# Altium schematic sheet ConverterSch.SchDoc: Steering Controller
size A3; Author: Harris Tomy & Neil Patil; Organization: The University of Auckland; Address1: Room XXX, Building 405; Address2: 20 Symonds Street; Address3: Auckland; Address4: New Zealand; Revision: 1R0; SheetNumber: 1; SheetTotal: 1
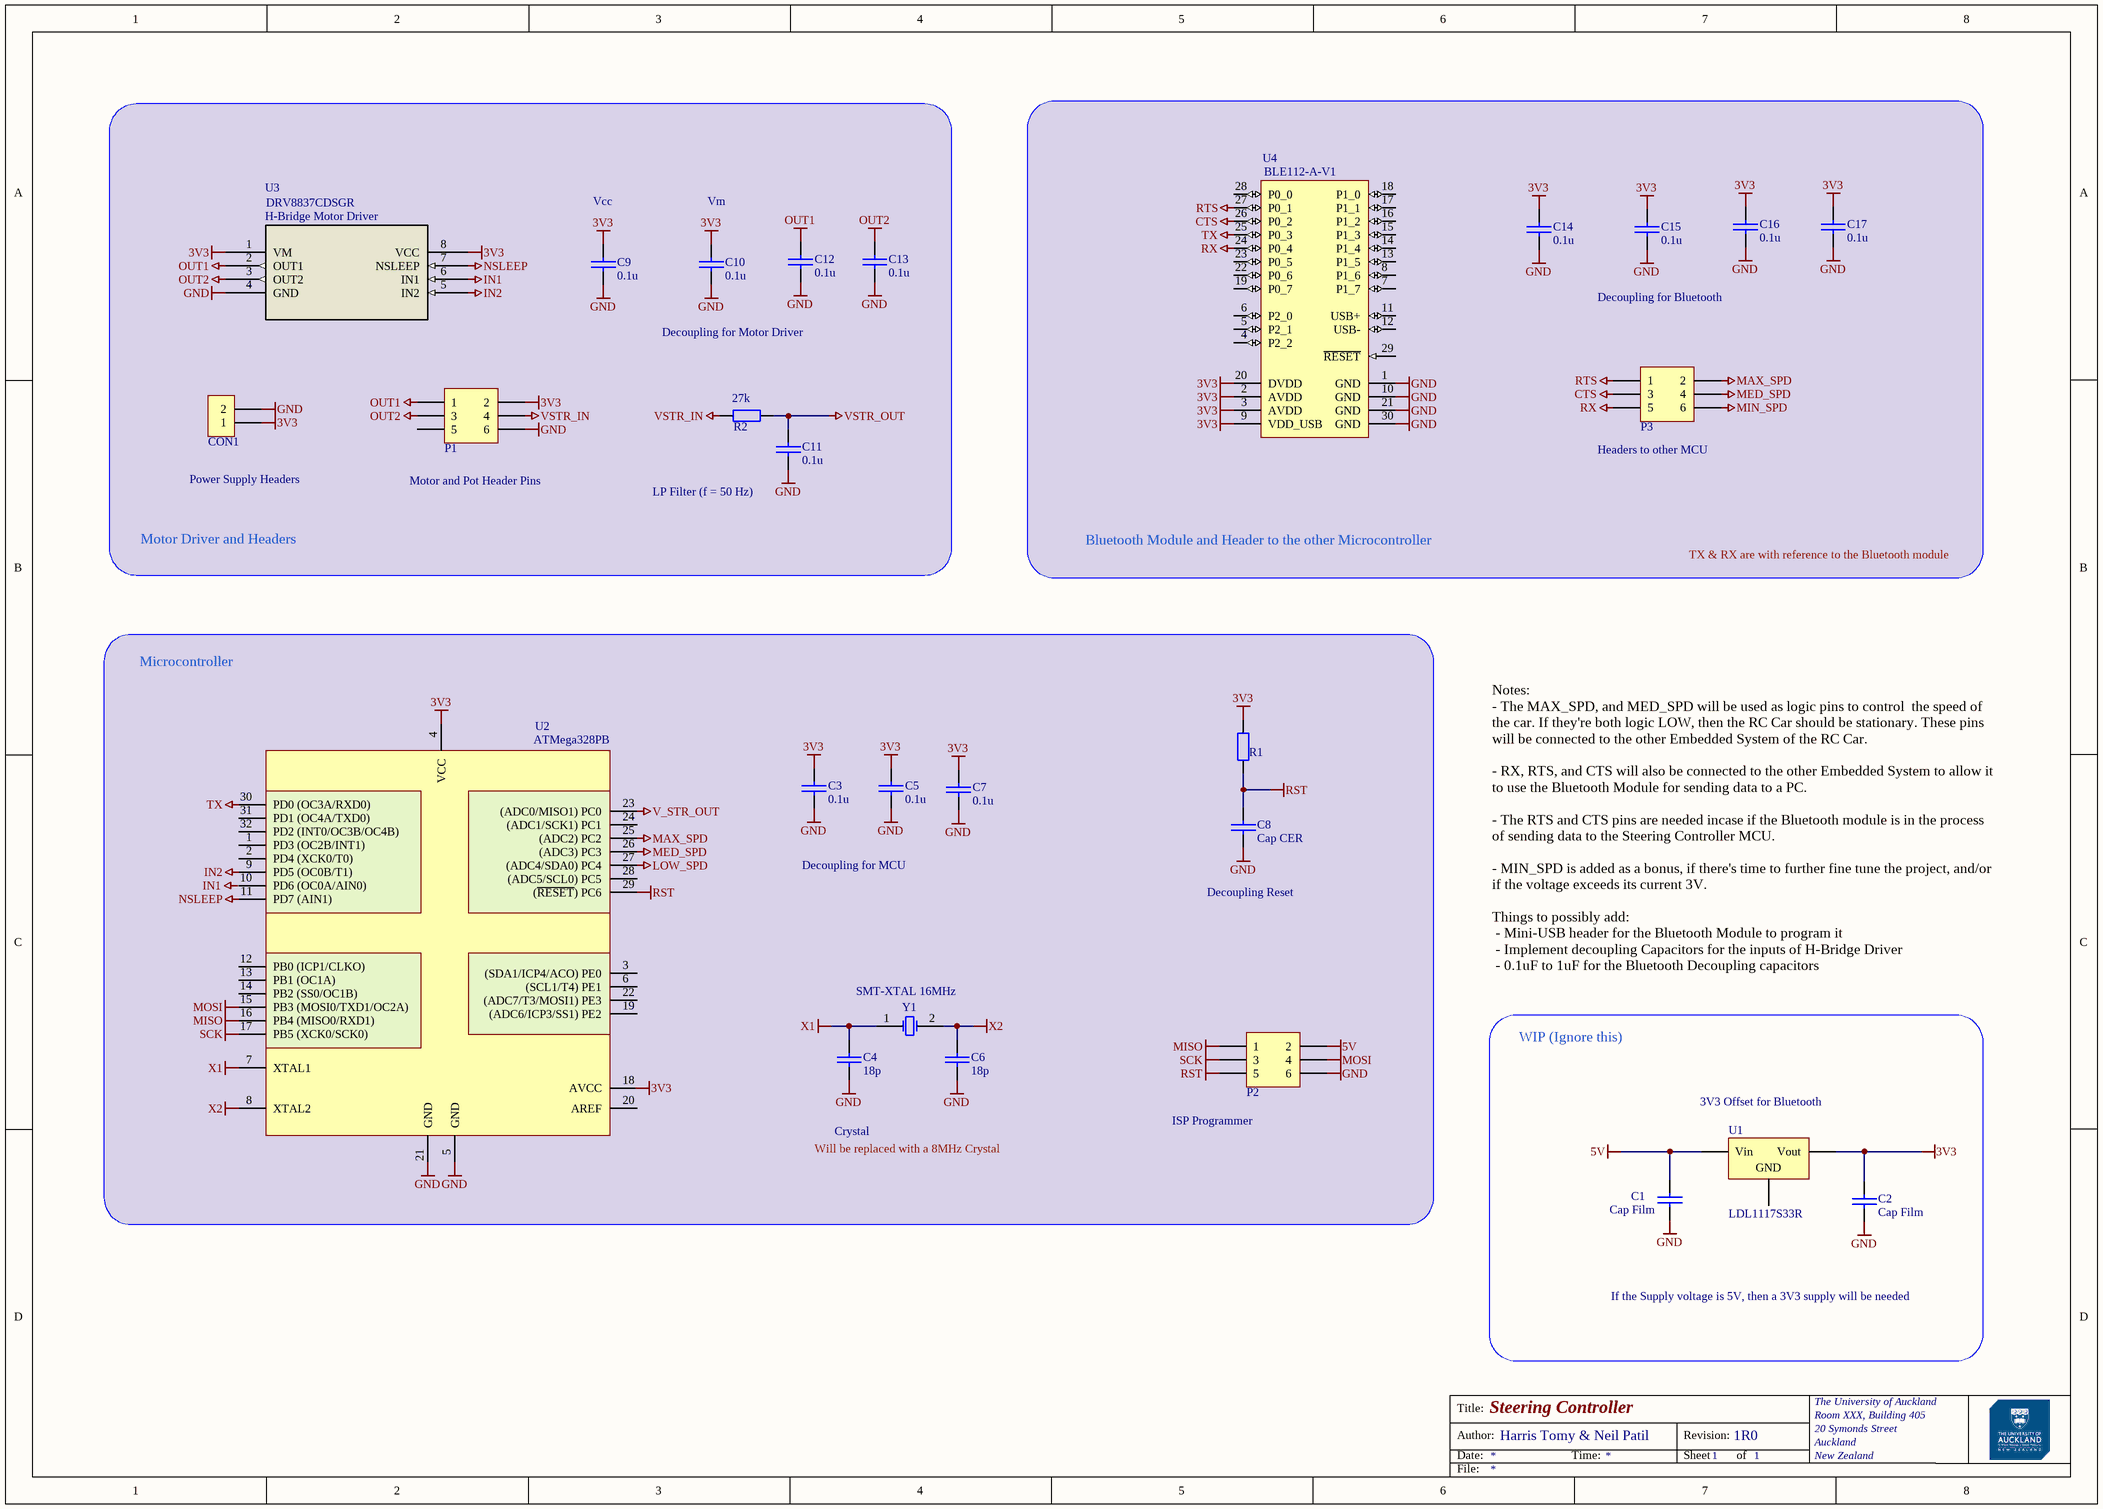
[diagram p0: ConverterSch.SchDoc]

## Parts
C1  Cap Film  [LDECE4150KA0N00]
C2  Cap Film  [LDECE4150KA0N00]
C3  0.1u  [C1206]
C4  18p  [C1206]
C5  0.1u  [C1206]
C6  18p  [C1206]
C7  0.1u  [C1206]
C8  Cap CER  [C1206]
C9  0.1u  [C1206]
C10  0.1u  [C1206]
C11  0.1u  [C1206]
C12  0.1u  [C1206]
C13  0.1u  [C1206]
C14  0.1u  [C1206]
C15  0.1u  [C1206]
C16  0.1u  [C1206]
C17  0.1u  [C1206]
CON1  Header 2X1  [HDR2X1_2P54]  (value not drawn)
P1  HDR3X2  [HDR2X3_2P54]  (value not drawn)
P2  HDR3X2  [HDR2X3_2P54]  (value not drawn)
P3  HDR3X2  [HDR2X3_2P54]  (value not drawn)
R1  Resistor 1206  [R1206]  (value not drawn)
R2  Resistor 0805  [R0805]  (value not drawn)
U1  LDL1117S33R  [SOT223L]
U2  ATMega328PB  [TQFP32]
U3  DRV8837CDSGR  [DSG8_P9X1P6_TEX]
U4  BLE112-A-V1  [BLUE-BLE112-A-V1_V]
Y1  SMT-XTAL 16MHz  [HC49-US]

## Blocks framed on the sheet
Motor Driver and Headers: C9-C13 CON1 P1 R2 U3
Bluetooth Module and Header to the other Microcontroller: C14-C17 P3 U4
Microcontroller: C3-C8 P2 R1 U2 Y1
WIP (Ignore this): C1 C2 U1

## Nets
3V3: C2.2 C3.2 C5.2 C7.2 C9.2 C10.2 C14.2 C15.2 C16.2 C17.2 CON1.1 P1.2 R1.1 U1.2(Vout) U2.4(VCC) U3.1(VM) U3.8(VCC) U4.2(AVDD) U4.3(AVDD) U4.9(VDD_USB) U4.20(DVDD)
5V: C1.2 P2.2 U1.3(Vin)
CTS: P3.3 U4.26(P0_2)
GND: C1.1 C2.1 C3.1 C4.1 C5.1 C6.1 C7.1 C8.1 C9.1 C10.1 C11.1 C12.1 C13.1 C14.1 C15.1 C16.1 C17.1 CON1.2 P1.6 P2.6 U2.5(GND) U2.21(GND) U3.4(GND) U4.1(GND) U4.10(GND) U4.21(GND) U4.30(GND)
IN1: U3.6(IN1)
IN2: U2.9(PD5_(OC0B/T1)) U3.5(IN2)
LOW_SPD: U2.27((ADC4/SDA0)_PC4)
MAX_SPD: P3.2 U2.25((ADC2)_PC2)
MED_SPD: P3.4 U2.26((ADC3)_PC3)
MIN_SPD: P3.6
MISO: P2.1 U2.16(PB4_(MISO0/RXD1))
MOSI: P2.4 U2.15(PB3_(MOSI0/TXD1/OC2A))
NSLEEP: U2.11(PD7_(AIN1)) U3.7(NSLEEP)
OUT1: C12.2 P1.1 U3.2(OUT1)
OUT2: C13.2 P1.3 U3.3(OUT2)
RST: C8.2 P2.5 R1.2 U2.29((~{RESET})_PC6)
RTS: P3.1 U4.27(P0_1)
RX: P3.5 U4.24(P0_4)
SCK: P2.3 U2.17(PB5_(XCK0/SCK0))
TX: U2.30(PD0_(OC3A/RXD0)) U4.25(P0_3)
V_STR_OUT: U2.23((ADC0/MISO1)_PC0)
VSTR_IN: P1.4 R2.1
VSTR_OUT: C11.2 R2.2
X1: C4.2 U2.7(XTAL1) Y1.1(OSC1)
X2: C6.2 U2.8(XTAL2) Y1.2(OSC2)

Not connected (* = marked no-connect by the designer): P1 5; U1 1(GND); U2 1(PD3_(OC2B/INT1)) 2(PD4_(XCK0/T0)) 3((SDA1/ICP4/ACO)_PE0) 6((SCL1/T4)_PE1) 10(PD6_(OC0A/AIN0)) 12(PB0_(ICP1/CLKO)) 13(PB1_(OC1A)) 14(PB2_(SS0/OC1B)) 18(AVCC) 19((ADC6/ICP3/SS1)_PE2) 20(AREF) 22((ADC7/T3/MOSI1)_PE3) 24((ADC1/SCK1)_PC1) 28((ADC5/SCL0)_PC5) 31(PD1_(OC4A/TXD0)) 32(PD2_(INT0/OC3B/OC4B)); U4 4(P2_2) 5(P2_1) 6(P2_0) 7(P1_7) 8(P1_6) 11(USB+) 12(USB-) 13(P1_5) 14(P1_4) 15(P1_3) 16(P1_2) 17(P1_1) 18(P1_0) 19(P0_7) 22(P0_6) 23(P0_5) 28(P0_0) 29(~{RESET})

## Notes on the sheet
- (near U3) H-Bridge Motor Driver
- (near C9) Vcc
- (near C10) Vm
- Decoupling for Bluetooth
- Decoupling for Motor Driver
- (near R2) 27k
- (near P3) Headers to other MCU
- (near CON1) Power Supply Headers
- (near P1) Motor and Pot Header Pins
- (near C11) LP Filter (f = 50 Hz)
- TX & RX are with reference to the Bluetooth module
- Decoupling for MCU
- (near C8) Decoupling Reset
- Notes:
  - The MAX_SPD, and MED_SPD will be used as logic pins to control  the speed of the car. If they're both logic LOW, then the RC Car should be stationary. These pins will be connected to the other Embedded System of the RC Car.
  - RX, RTS, and CTS will also be connected to the other Embedded System to allow it to use the Bluetooth Module for sending data to a PC.
  - The RTS and CTS pins are needed incase if the Bluetooth module is in the process of sending data to the Steering Controller MCU.
  - MIN_SPD is added as a bonus, if there's time to further fine tune the project, and/or if the voltage exceeds its current 3V.
  Things to possibly add:
  - Mini-USB header for the Bluetooth Module to program it
  - Implement decoupling Capacitors for the inputs of H-Bridge Driver
  - 0.1uF to 1uF for the Bluetooth Decoupling capacitors
- (near P2) ISP Programmer
- (near U1) 3V3 Offset for Bluetooth
- Will be replaced with a 8MHz Crystal
- Crystal
- If the Supply voltage is 5V, then a 3V3 supply will be needed
- Labels drawn without touching a wire or pin: 3V3, IN1
- Title:
- Author:
- Date:
- Time:
- Revision:
- Sheet
- of
- File:

## Library data of the parts
C1 C2 = Cap Film SMD LDECE4150KA0N00: CAP FILM 1.5UF 10% 50VDC 2824; Manufacturer: KEMET; Type: Surface mount; Value: 1.5uF/50V; MPN: LDECE4150KA0N00; Supplier 1: Element14; Supplier 2: RSComponents; Part Description: CAP FILM 1.5UF 10% 50VDC 2824; Supplier Part Number 4: 80-LDECE4150KA0N00; Supplier Part Number 3: 399-12858-1-ND; Supplier Part Number 2: 1650342; Supplier Part Number 1: 2495712; Supplier 4: Mouser; Supplier 3: Digi-Key
C3-C17 = Cap CER Decoup C3216C0G2A104J160AC: CAP CER 0.1UF 100V C0G 1206; Manufacturer: TDK Corporation; Type: Surface mount; Value: 100nF/100V; Supplier 1: RSComponents; Supplier Part Number 1: 1795799; MPN: C3216C0G2A104J160AC; Supplier 2: Element14; Part Description: CAP CER 0.1UF 100V C0G 1206; Supplier Part Number 4: 810-C3216C0G2A104J6C; Supplier Part Number 3: 445-172677-1-ND; Supplier Part Number 2: 2906828; Supplier 4: Mouser; Supplier 3: Digi-Key
CON1 = HDR2X1
P1-P3 = HDR3X2: Header, 3-Pin, Dual row
R1 = RES1206: MPN: ?; Type: Surface Mount; Value: ?; Part Description: ?
R2 = RES0805: MPN: ?; Value: ?; Part Description: ?; Type: Surface Mount
U1 = LDO LDL1117S33R: IC REG LINEAR 3.3V 1.2A SOT223; Manufacturer: STMicroelectronics; Value: 3.3V/1.2A; MPN: LDL1117S33R; Supplier 1: Element14; Type: Surface mount; Part Description: IC REG LINEAR 3.3V 1.2A SOT223; Supplier Part Number 3: 511-LDL1117S33R; Supplier Part Number 2: 497-17239-1-ND; Supplier Part Number 1: 2729708; Supplier 3: Mouser; Supplier 2: Digi-Key
U2 = ATMega328PB: IC MCU 8BIT 32KB FLASH 32TQFP; Supplier 1: Digi-Key; Supplier Part Number 1: ATMEGA328PB-AU-ND; Supplier 2: Digikey; Supplier Part Number 2: ATMEGA328PB-AU-ND
U3 = DRV8837CDSGR: No Description Available; Vendor: Texas Instruments; Built_By: EMA_Jessica; SourceLibrary: TI_2019-03-25_3; Manufacturer_Part_Number: DRV8837CDSGR; Copyright: Copyright (C) 2018 Accelerated Designs. All rights reserved; RefDes: RefDes; Type: DEV
U4 = BLE112-A-V1: Bluetooth(R) Low Energy Single Mode Module / , 2 to 3.6 V, -40 to 85 degC, 30-Pin SMD, RoHS, Tape and Reel; Min Supply Voltage: 2.1 V; Max Supply Voltage: 3.6 V; RoHSCompliant: true; ComponentLink1Description: Manufacturer URL; Min Operating Temperature: -40 degC; ComponentLink2Description: Datasheet; DatasheetVersion: Rev. 1.4, 05/2013; ComponentLink1URL: www.bluegiga.com; Packaging: Cut Tape; Pins: 64; REACH SVHC: No SVHC; Max Operating Temperature: 85 degC; PackageDescription: 30-Pin Surface Mount Device, Body 12.05 x 18.1 mm, Pitch 1.25 mm; ComponentLink2URL: http://www.mouser.com/ds/2/368/Bluegiga_Technologies_BLE112_Datasheet-558666.pdf; PackageReference: BLE112-A-V1; PartNumber: BLE112-A-V1
Y1 = TXC9C-16_XTAL_SMT: 9C-16.000MAAJ-T crystal 16.0000MHZ 18PF SMD; Manufacturer: TXC CORPORATION; Frequency Stability: ±30ppm; Operating Mode: Fundamental; Supplier 1: Digi-Key; Manufacturer Part Number: 9C-16.000MAAJ-T; RoHS: RoHS Compliant; Category: Crystals, Oscillators, Resonators; Stock 1: 11514; Pricing 1: 1=0.75, 10=0.628, 50=0.5656, 100=0.5026, 500=0.47744 (NZD); Packaging: Cut Tape (CT); Part Status: Active; Type: MHz Crystal; Frequency Tolerance: ±30ppm; Load Capacitance: 18pF; Operating Temperature: -20°C ~ 70°C; Ratings: -; Mounting Type: Surface Mount; Package / Case: HC-49/US; Size / Dimension: 0.449" L x 0.189" W (11.40mm x 4.80mm); Height - Seated (Max): 0.161" (4.10mm); ComponentLink1URL: http://www.txccorp.com/download/products/quartz_crystals/2015TXC_9C_32.pdf; ComponentLink1Description: http://www.txccorp.com/download/products/quartz_crystals/2015TXC_9C_32.pdf; Supplier Part Number 1: 887-1059-1-ND